# EAGLE design laserboard (EAGLE 7.5.0)
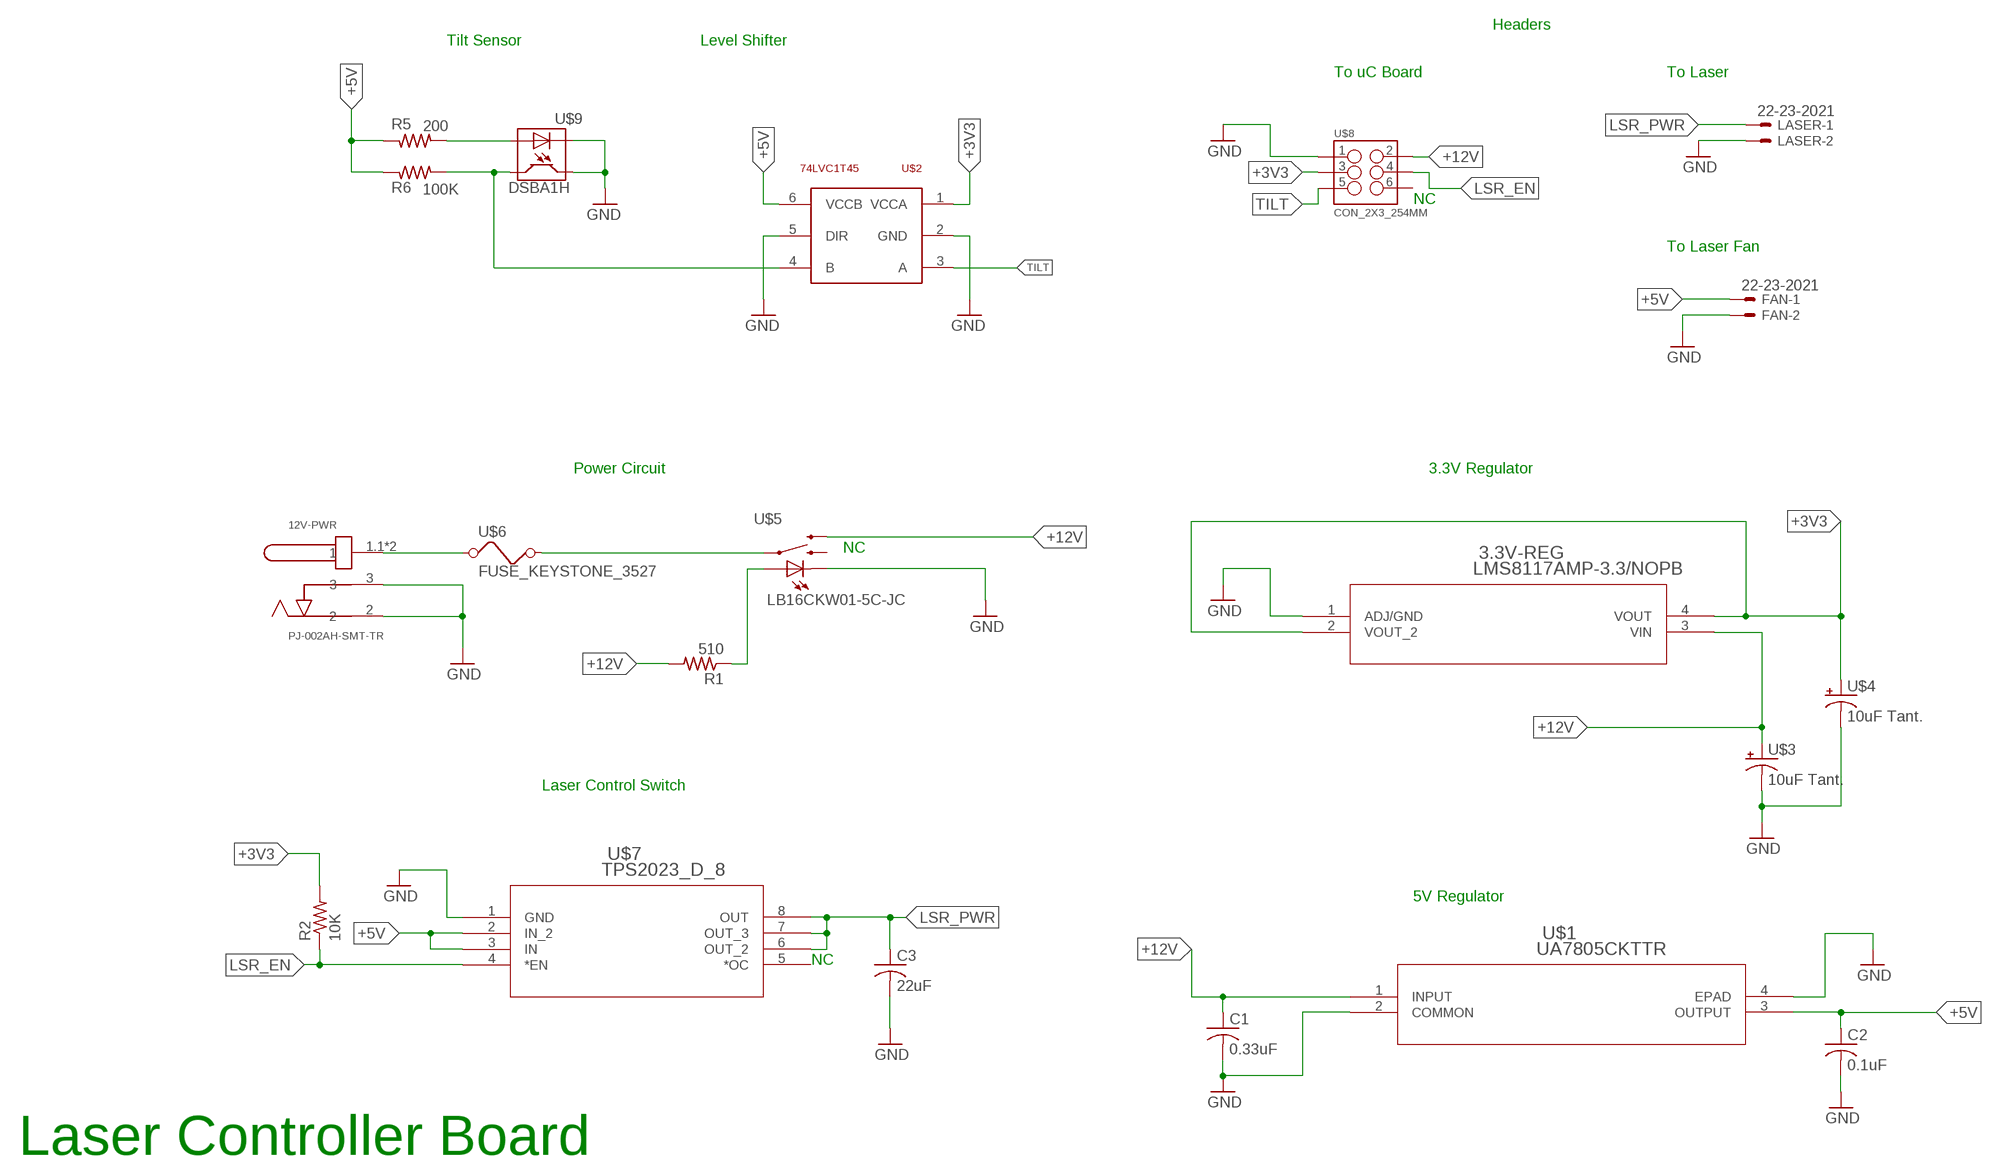
[diagram p0: schematic, sheet 1]

## Parts
3.3V-REG  LMS8117AMP-3.3/NOPB  [MP04A]
12V-PWR  PJ-002AH-SMT-TR  [CUI_PJ-002AH-SMT-TR]
C1  0.33uF  C-USC0805  [C0805]
C2  0.1uF  C-USC0805  [C0805]
C3  22uF  C-USC0805  [C0805]
FAN  22-23-2021  [22-23-2021]
LASER  22-23-2021  [22-23-2021]
R1  510  R-US_R0805  [R0805]
R2  10K  R-US_R0805  [R0805]
R5  200  R-US_R0805  [R0805]
R6  100K  R-US_R0805  [R0805]
U$1  UA7805CKTTR  [KTT3_6P22X6P6]
U$2  74LVC1T45  [SOT363]
U$3  10uF Tant.  CAPACITOR_POL_0805  [C0805]
U$4  10uF Tant.  CAPACITOR_POL_0805  [C0805]
U$5  LB16CKW01-5C-JC  [LB16CKW01-5C-JC]
U$6  FUSE_KEYSTONE_3527  [KEYSTONE3527]
U$7  TPS2023_D_8  [D8]
U$8  CON_2X3_254MM  [CON_2X3_254MM]
U$9  DSBA1H  [DSBA1H]

## Nets
+3V3: 3.3V-REG.2(VOUT_2) 3.3V-REG.4(VOUT) R2.2 U$2.1(VCCA) U$4.+ U$8.3
+5V [Laser 5v]: C2.1 FAN.1 R5.1 R6.1 U$1.3(OUTPUT) U$2.6(VCCB) U$7.2(IN_2) U$7.3(IN)
+12V: 3.3V-REG.3(VIN) C1.1 R1.2 U$1.1(INPUT) U$3.+ U$5.2 U$8.2
GND: 3.3V-REG.1(ADJ/GND) 12V-PWR.2 12V-PWR.3 C1.2 C2.2 C3.2 FAN.2 LASER.2 U$1.2(COMMON) U$1.4(EPAD) U$2.2(GND) U$2.5(DIR) U$3.- U$4.- U$5.- U$7.1(GND) U$8.1 U$9.- U$9.E
LSR_EN: R2.1 U$7.4(*EN) U$8.4
LSR_PWR [Laser 5v]: C3.1 LASER.1 U$7.6(OUT_2) U$7.7(OUT_3) U$7.8(OUT)
N$1: R1.1 U$5.+
N$2: 12V-PWR.1.1 12V-PWR.1.2 U$6.P$1
N$3: U$5.1 U$6.P$2
N$5: R6.2 U$2.4(B) U$9.C
N$7: R5.2 U$9.+
TILT: U$2.3(A) U$8.5
Unconnected: U$5.3 U$7.5(*OC) U$8.6

## Notes on the sheet
- Headers
- Tilt Sensor | Level Shifter
- To uC Board | To Laser
- NC
- To Laser Fan
- Power Circuit | 3.3V Regulator
- NC
- Laser Control Switch
- 5V Regulator
- NC
- Laser Controller Board

## Library data of the parts
3.3V-REG = LMS8117AMP-3_3NOPB:LMS8117AMP-3.3/NOPB; COPYRIGHT: Copyright (C) 2015 Accelerated Designs. All rights reserved; MANUFACTURER_PART_NUMBER: LMS8117AMP-33; VENDOR: National Semiconductor
12V-PWR = PJ-002AH-SMT-TR:PJ-002AH-SMT-TR: PJ-002 Series 2 x 6.5 mm 24 V Right Angle SMT Power Jack
C1-C3 = rcl:C-US: CAPACITOR, American symbol
FAN LASER = con-molex:22-23-2021: .100" (2.54mm) Center Header - 2 Pin; MF: MOLEX; MPN: 22-23-2021; OC_FARNELL: 1462926; OC_NEWARK: 25C3832
R1 R2 R5 R6 = rcl:R-US_: RESISTOR, American symbol
U$1 = UA7805CKTTR:UA7805CKTTR; COPYRIGHT: Copyright (C) 2015 Accelerated Designs. All rights reserved; DATASHEETURL: http://www.ti.com/lit/gpn/UA7805; DESCRIPTION: 3 Pin 1.5A Fixed 5V Positive Voltage Regulator; FAMILY_NAME: STANDARD VOLTAGE REGULATOR; GENERIC_PART_NUMBER: UA7805; INDUSTRY_STD_PKG_TYPE: DDPAK/TO-263; MANUFACTURER: Texas Instruments; MANUFACTURER_PART_NUMBER: ua7805_ktt_3; PACKAGE_DESIGNATOR: KTT; PIN_COUNT: 3; VENDOR: Texas Instruments
U$2 = ChristiansCustom:74LVC1T45
U$3 U$4 = ChristiansCustom:CAPACITOR_POL_0805
U$5 = ChristiansCustom:LB16CKW01-5C-JC
U$6 = ChristiansCustom:FUSE_KEYSTONE_3527
U$7 = TPS2023D:TPS2023_D_8; COPYRIGHT: Copyright (C) 2015 Accelerated Designs. All rights reserved; DATASHEETURL: http://www.ti.com/lit/gpn/TPS2023; DESCRIPTION: 1.65A, 2.7-5.5V Single Power Distribution Switch IC Hi-Side MOSFET, Fault Report, Act-Low Enable; FAMILY_NAME: USB POWER SWITCH; GENERIC_PART_NUMBER: TPS2023; INDUSTRY_STD_PKG_TYPE: SOIC; MANUFACTURER: Texas Instruments; MANUFACTURER_PART_NUMBER: tps2023_d_8; PACKAGE_DESIGNATOR: D; PIN_COUNT: 8; VENDOR: Texas Instruments
U$8 = ChristiansCustom:CON_2X3_254MM
U$9 = ChristiansCustom:DSBA1H

## Board
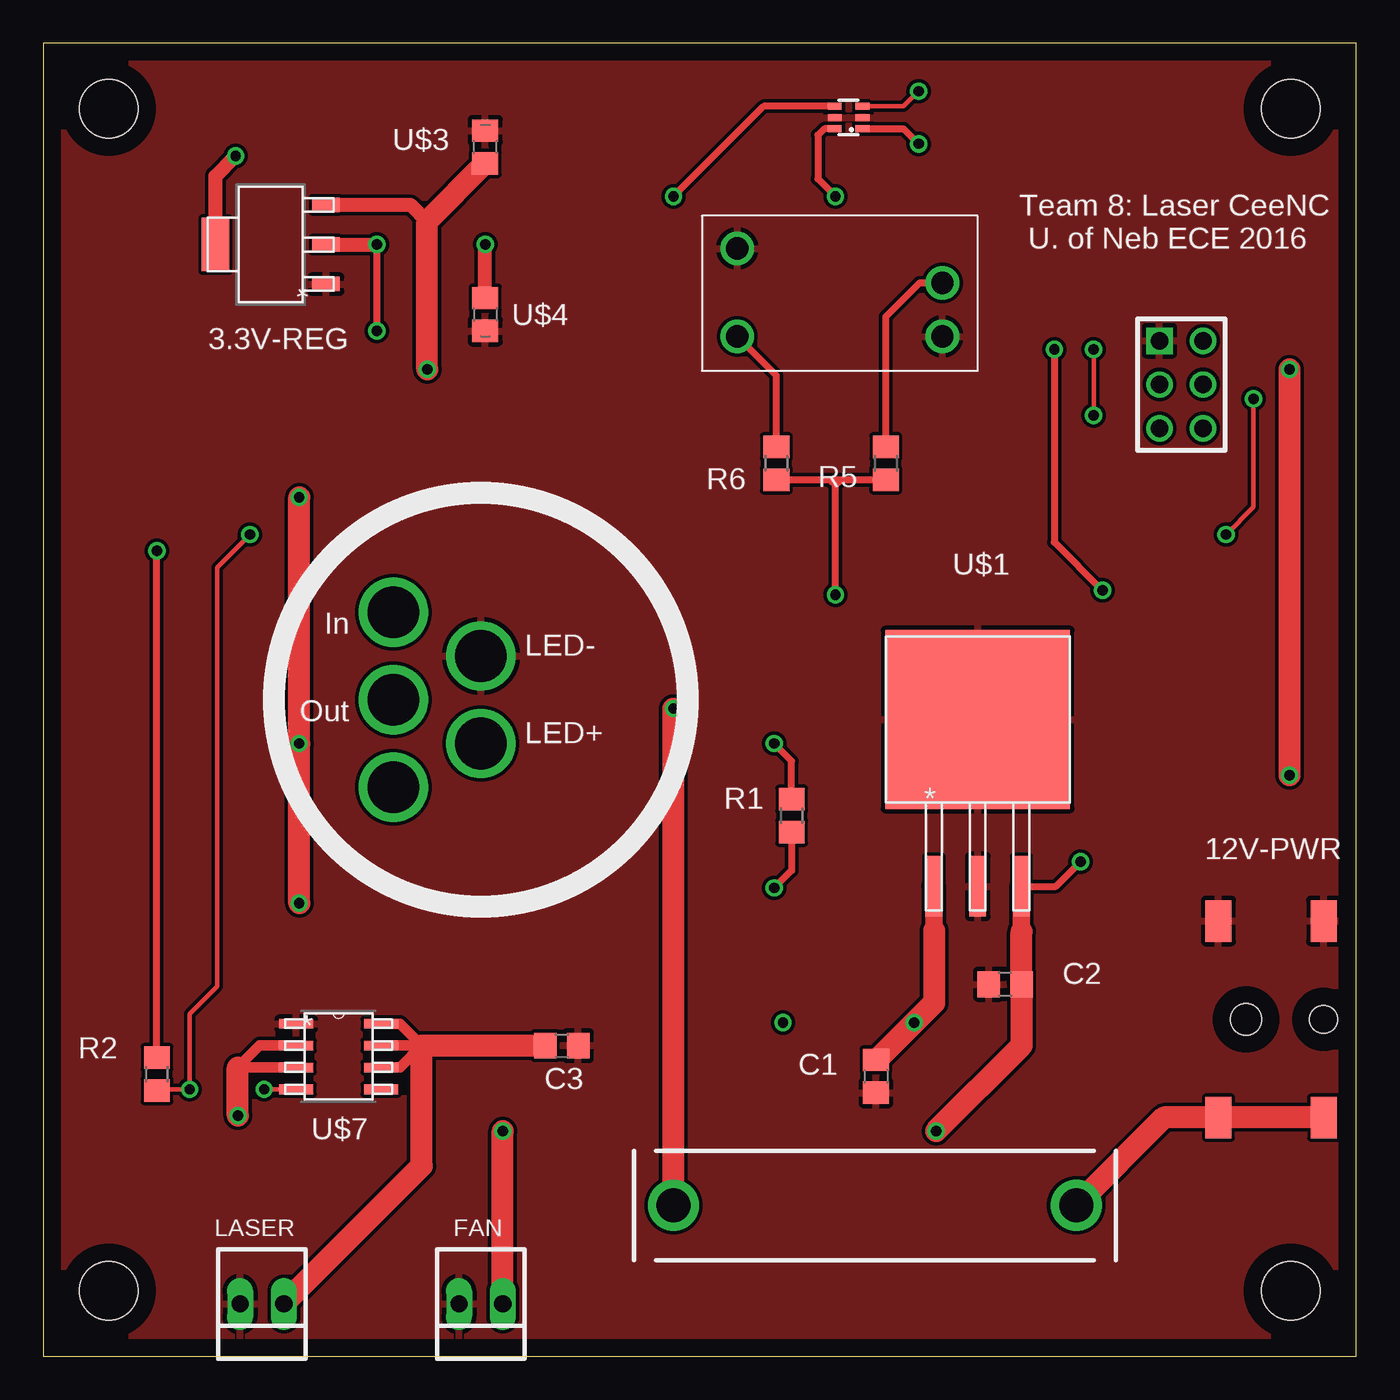
[diagram p1: board, top side]
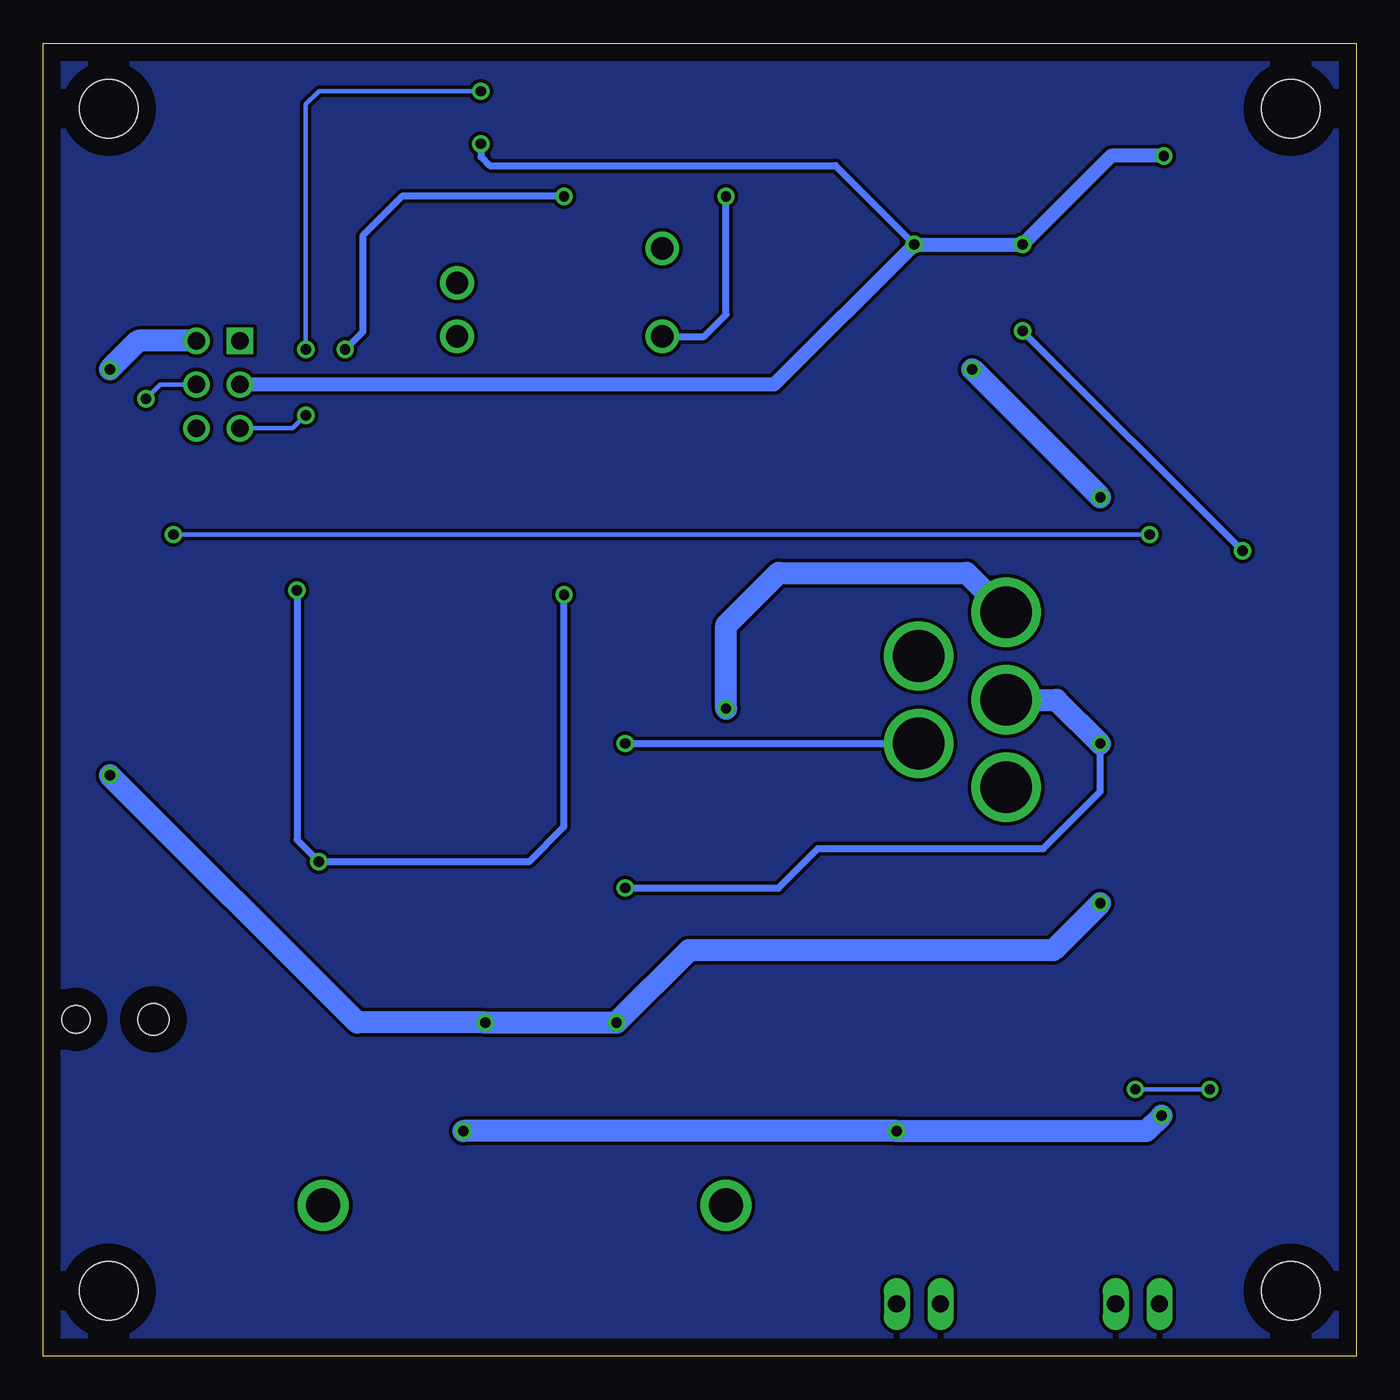
[diagram p2: board, bottom side, seen from below]

Size 76.2 x 76.2 mm. Coordinates in mm from the lower left corner, seen from the top.
Outline: 0,0 76.2,0 76.2,76.2 0,76.2 0,0
Copper layers (1*16): Top 0.035mm / dielectric 1.5mm / Bottom 0.035mm
Design rules "default": minimum track width 10mil, minimum drill 24mil, track to track 8mil, track to pad 8mil, pad to pad 8mil, via to via 8mil, smd to smd 8mil, copper to edge 40mil, drill to drill 8mil, minimum pad ring 10mil, minimum via ring 8mil, stop-mask expansion 4mil, vias tented up to drill 0mil, thermal gap 10mil
Holes 3.4 mm at 3.81,72.39 72.39,3.81 72.39,72.39 3.81,3.81

### Footprints (pad centres in the part's own frame; a part is rotated, then mirrored left to right if it is on the bottom)
MP04A = smd 1.6 x 0.838: 1 -3.2,2.3; 2 -3.2,0; 3 -3.2,-2.3 | smd 1.6 x 3.099: 4 3.2,0
CUI_PJ-002AH-SMT-TR = smd 1.5 x 2.4: 1.1 -3.05,5.7; 1.2 3.05,5.7; 2 -3.05,-5.7; 3 3.05,-5.7 | hole 1.6: -3.05,0 | hole 1.8: 1.45,0
C0805 = smd 1.3 x 1.5: 1 -0.95,0; 2 0.95,0
22-23-2021 = drill 1 long: 1 -1.27,0; 2 1.27,0
R0805 = smd 1.3 x 1.5: 1 -0.95,0; 2 0.95,0
KTT3_6P22X6P6 = smd 0.965 x 3.505: 1 -2.54,-9.677; 2 0,-9.677; 3 2.54,-9.677 | smd 10.719 x 10.363: 4 0,0
SOT363 = smd 0.4 x 0.8: 1 -0.65,-0.8; 2 0,-0.8; 3 0.65,-0.8; 4 0.65,0.8; 5 0,0.8; 6 -0.65,0.8
C0805' = smd 1.3 x 1.5: + -0.95,0; - 0.95,0
LB16CKW01-5C-JC = drill 3: 1 -5.08,5.08; 2 -5.08,0; 3 -5.08,-5.08; + 0,-2.54; - 0,2.54
KEYSTONE3527 = drill 1.981: P$1 -11.684,0; P$2 11.684,0
D8 = smd 1.981 x 0.559: 1 -2.464,1.905; 2 -2.464,0.635; 3 -2.464,-0.635; 4 -2.464,-1.905; 5 2.464,-1.905; 6 2.464,-0.635; 7 2.464,0.635; 8 2.464,1.905
CON_2X3_254MM = drill 1.02 square: 1 -2.54,-1.27 | drill 1.02: 2 -2.54,1.27; 3 0,-1.27; 4 0,1.27; 5 2.54,-1.27; 6 2.54,1.27
DSBA1H = drill 1.3: + 5.95,3.1; - -5.95,5.1; C -5.95,0; E 5.95,0

### Placement (x,y rotation side)
3.3V-REG  13.21,64.52 180 top
12V-PWR  71.25,19.56 180 top
C1  48.32,16.26 270 top
C2  55.82,21.59 180 top
C3  30.1,18.03 0 top
FAN  25.4,3.05 180 top
LASER  12.7,3.05 180 top
R1  43.43,31.37 270 top
R2  6.6,16.38 90 top
R5  48.9,51.82 90 top
R6  42.55,51.82 90 top
U$1  54.23,36.96 0 top
U$2  46.74,71.88 90 top
U$3  10uF Tant.  [C0805']  25.65,70.17 90 top
U$4  10uF Tant.  [C0805']  25.65,60.45 270 top
U$5  25.4,38.1 0 top
U$6  48.26,8.76 180 top
U$7  17.14,17.4 0 top
U$8  66.04,56.39 270 top
U$9  46.23,59.18 0 top

### Tracks (layer width: path | path; a pad name or v marks a point on that pad's centre or on a via)
+3V3  (via drill 0.6)
  Top 0.406: R2.2 v6.6,46.74 | v19.37,59.5 v19.37,64.52 | U$2.1 49.93,71.23 v50.8,70.36
  Top 0.813: 3.3V-REG.2 v19.37,64.52 | U$4.+ v25.65,64.52 | 3.3V-REG.4 10.01,68.49 v11.18,69.66
  Bottom 0.406: v6.6,46.74 v19.37,59.5 | v50.8,70.36 50.8,69.6 50.29,69.09 30.23,69.09 v25.65,64.52
  Bottom 0.813: v11.18,69.66 14.22,69.66 v19.37,64.52 v25.65,64.52 33.78,56.39 U$8.3
+5V  (via drill 0.6)
  Top 0.406: R6.1 45.97,50.87 | 45.97,50.87 R5.1 | U$1.3 58.78,27.28 v60.2,28.7 | v45.97,44.2 45.97,50.55 | 45.97,50.55 45.97,50.87 | U$2.6 45.32,71.23 44.96,70.87 44.96,68.33 v45.97,67.31 | v58.67,58.42 58.67,47.24 v61.47,44.45 | 45.97,50.55 46.23,50.8 | 45.97,50.55 45.72,50.8
  Top 0.61: U$7.3 11.3,16.76 12.57,18.03 U$7.2
  Top 1.016: 56.77,24.64 U$1.3
  Top 1.27: v11.3,13.97 11.3,16.76 | 56.77,24.64 C2.1 56.77,18.03 v51.82,13.08 | FAN.1 v26.67,13.08
  Bottom 0.406: v45.97,67.31 55.37,67.31 57.66,65.02 57.66,59.44 v58.67,58.42 | v61.47,44.45 61.47,29.97 v60.2,28.7 48.01,28.7 45.97,30.73 v45.97,44.2
  Bottom 1.27: v11.3,13.97 12.19,13.08 v26.67,13.08 v51.82,13.08
+12V  (via drill 0.6)
  Top 0.406: R1.2 43.43,28.19 v42.42,27.18
  Top 0.813: 3.3V-REG.3 21.32,66.82 22.29,65.85
  Top 1.016: 51.66,27.3 U$1.1 51.69,24.7
  Top 1.27: v14.86,26.29 v14.86,35.56 v14.86,49.85 | v22.29,57.28 22.29,65.85 U$3.+ | 51.69,24.7 51.69,20.51 v50.55,19.37 48.38,17.21 C1.1 | v72.33,33.72 v72.33,57.28
  Bottom 0.406: v42.42,27.18 33.53,27.18 31.24,29.46 18.16,29.46 14.86,32.77 v14.86,35.56
  Bottom 1.27: U$5.2 17.4,38.1 v14.86,35.56 | v14.86,49.85 v22.29,57.28 | U$8.2 70.67,58.93 v72.33,57.28 | v72.33,33.72 57.98,19.37 v50.55,19.37 v42.93,19.37 38.73,23.56 17.59,23.56 v14.86,26.29
GND
  pour Top: -0.51,76.71 76.71,76.71 76.71,-0.51 -0.51,-0.51
LSR_EN  (via drill 0.6)
  Top 0.254: U$7.4 v12.83,15.49 | R2.1 6.67,15.49 v8.51,15.49 8.51,19.88 10.1,21.46 10.1,45.78 v12,47.69 | v68.64,47.69 70.23,49.28 v70.23,55.56
  Bottom 0.254: v12,47.69 v68.64,47.69 | v70.23,55.56 69.41,56.39 U$8.4 | v8.51,15.49 v12.83,15.49
LSR_PWR
  Top 0.61: U$7.8 20.7,19.3 21.97,18.03 | U$7.7 21.97,18.03 | U$7.6 20.7,16.76 21.97,18.03
  Top 1.27: LASER.1 21.97,11.05 21.97,18.03 C3.1
N$1  (via drill 0.6)
  Top 0.406: R1.1 43.43,34.54 v42.42,35.56
  Bottom 0.406: v42.42,35.56 U$5.+
N$2
  Top 1.27: 12V-PWR.1.1 12V-PWR.1.2 65.04,13.86 U$6.P$1
N$3  (via drill 0.6)
  Top 1.27: U$6.P$2 v36.58,37.59
  Bottom 1.27: U$5.1 22.61,45.47 33.53,45.47 36.58,42.42 v36.58,37.59
N$4
  pour Bottom: -0.51,76.71 76.71,76.71 76.71,-0.51 -0.51,-0.51
N$5  (via drill 0.6)
  Top 0.406: R6.2 42.55,56.91 U$9.C | v36.58,67.31 41.8,72.53 U$2.4
  Bottom 0.406: U$9.C 37.85,59.18 36.58,60.45 v36.58,67.31
N$7
  Top 0.406: U$9.+ 50.85,62.28 48.9,60.33 R5.2
TILT  (via drill 0.6)
  Top 0.254: U$2.3 49.93,72.53 v50.8,73.41 | v60.96,58.42 v60.96,54.61
  Bottom 0.254: v50.8,73.41 60.2,73.41 60.96,72.64 v60.96,58.42 | v60.96,54.61 61.72,53.85 U$8.5

### Text on the board
tPlace: Team 8: Laser CeeNC / U. of Neb ECE 2016